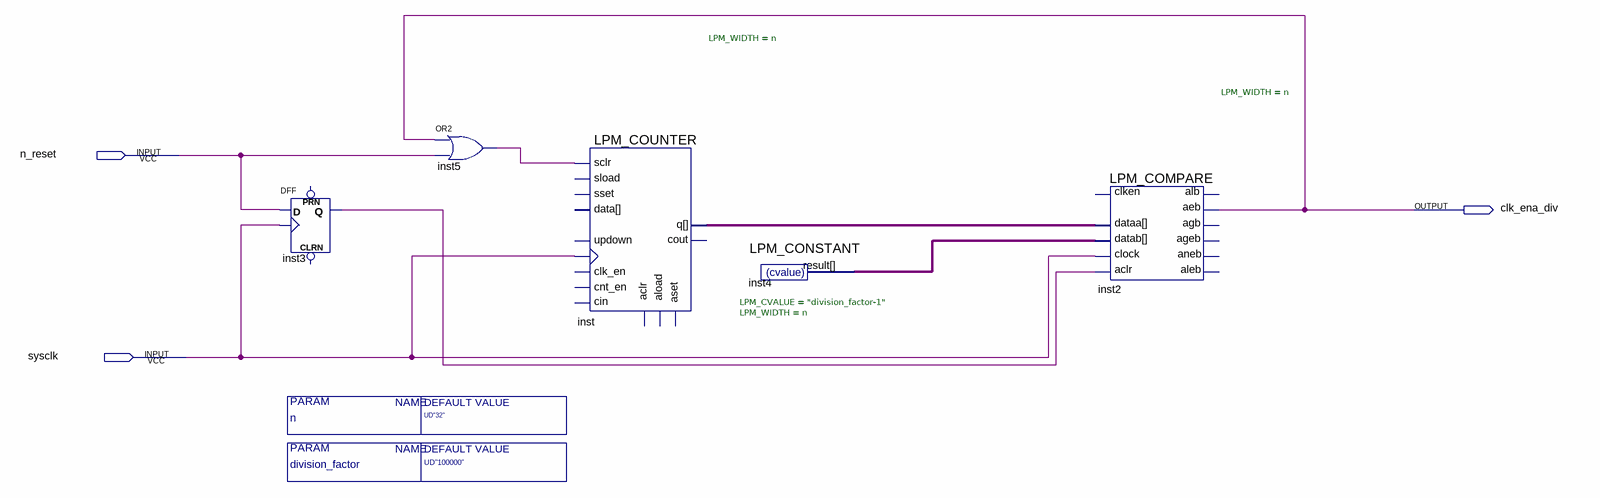
[diagram p0: schematic sheet]
// Quartus schematic clk_divider_altera.bdf as structural Verilog: 5 symbols, 3 pins
module clk_divider_altera #(parameter n = "UD\"32\"", parameter division_factor = "UD\"100000\"") (
  input  n_reset,
  input  sysclk,
  output clk_ena_div
);

  wire inst3_q, inst4_result, inst5_out, inst_q;

  DFF inst3 (.CLK(sysclk), .D(n_reset), .Q(inst3_q));  // open: CLRN, PRN
  or inst5 (inst5_out, clk_ena_div, n_reset);
  LPM_COUNTER #(.LPM_WIDTH(n)) inst (
    .clock(sysclk), .sclr(inst5_out), .q(inst_q));  // open: sload, data, clk_en, aload, aclr, aset, cin, sset, updown, cnt_en, cout
  LPM_CONSTANT #(.LPM_CVALUE("division_factor-1"), .LPM_WIDTH(n)) inst4 (.result(inst4_result));
  LPM_COMPARE #(.LPM_WIDTH(n)) inst2 (
    .dataa(inst_q), .datab(inst4_result), .clock(sysclk), .aclr(inst3_q), .aeb(clk_ena_div));  // open: clken, aleb, agb, aneb, ageb, alb
endmodule
